# Altium schematic sheet 红外倒车雷达.SchDoc
size A4; SheetNumber: 2; SheetTotal: 2
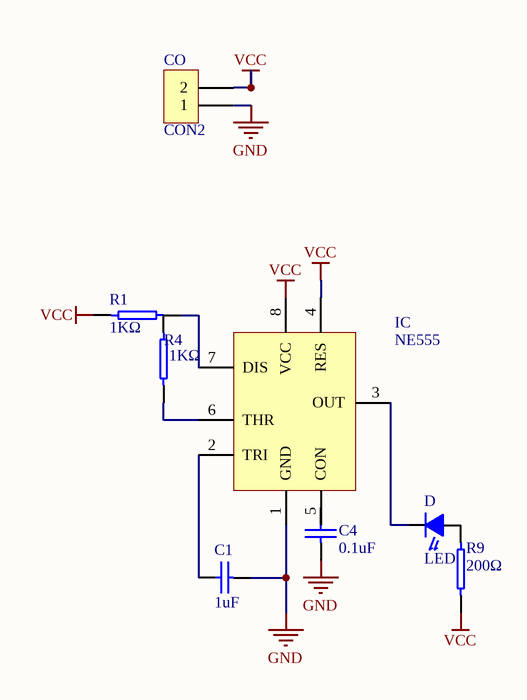
[diagram p0: 红外倒车雷达.SchDoc]

## Parts
C1  1uF  [CAP-D]
C4  0.1uF  [CAP-D]
CO  CON2  [SIP2]
D  LED  [LED]
IC  NE555  [DIP8]
R1  1KΩ  [RES-1/2W-1]
R4  1KΩ  [RES-1/2W-1]
R9  200Ω  [RES-1/2W-1]

## Nets
GND: C1.1 C4.1 CO.1 IC.1(GND)
VCC: CO.2 IC.4(RES) IC.8(VCC) R1.2 R9.1
NetC1_2: C1.2 IC.2(TRI)
NetD_1: D.1 R9.2
NetD_2: D.2 IC.3(OUT)
NetIC_6: IC.6(THR) R4.1
NetIC_7: IC.7(DIS) R1.1

Not connected (* = marked no-connect by the designer): C4 2; IC 5(CON); R4 2

## Library data of the parts
C1 C4 = CAP-2
R1 R4 R9 = RES-2